# Altium schematic sheet Top.SchDoc: ECU V2
size 420 x 297 mm; Date: 10/25/22; Author: Joseph Telaak; CompanyName: autogolfc.art; DrawnBy: Joseph Telaak; Engineer: Joseph Telaak; Organization: autogolfc.art; Revision: 2.1; SheetNumber: 1; SheetTotal: 11; Time: OCT 20
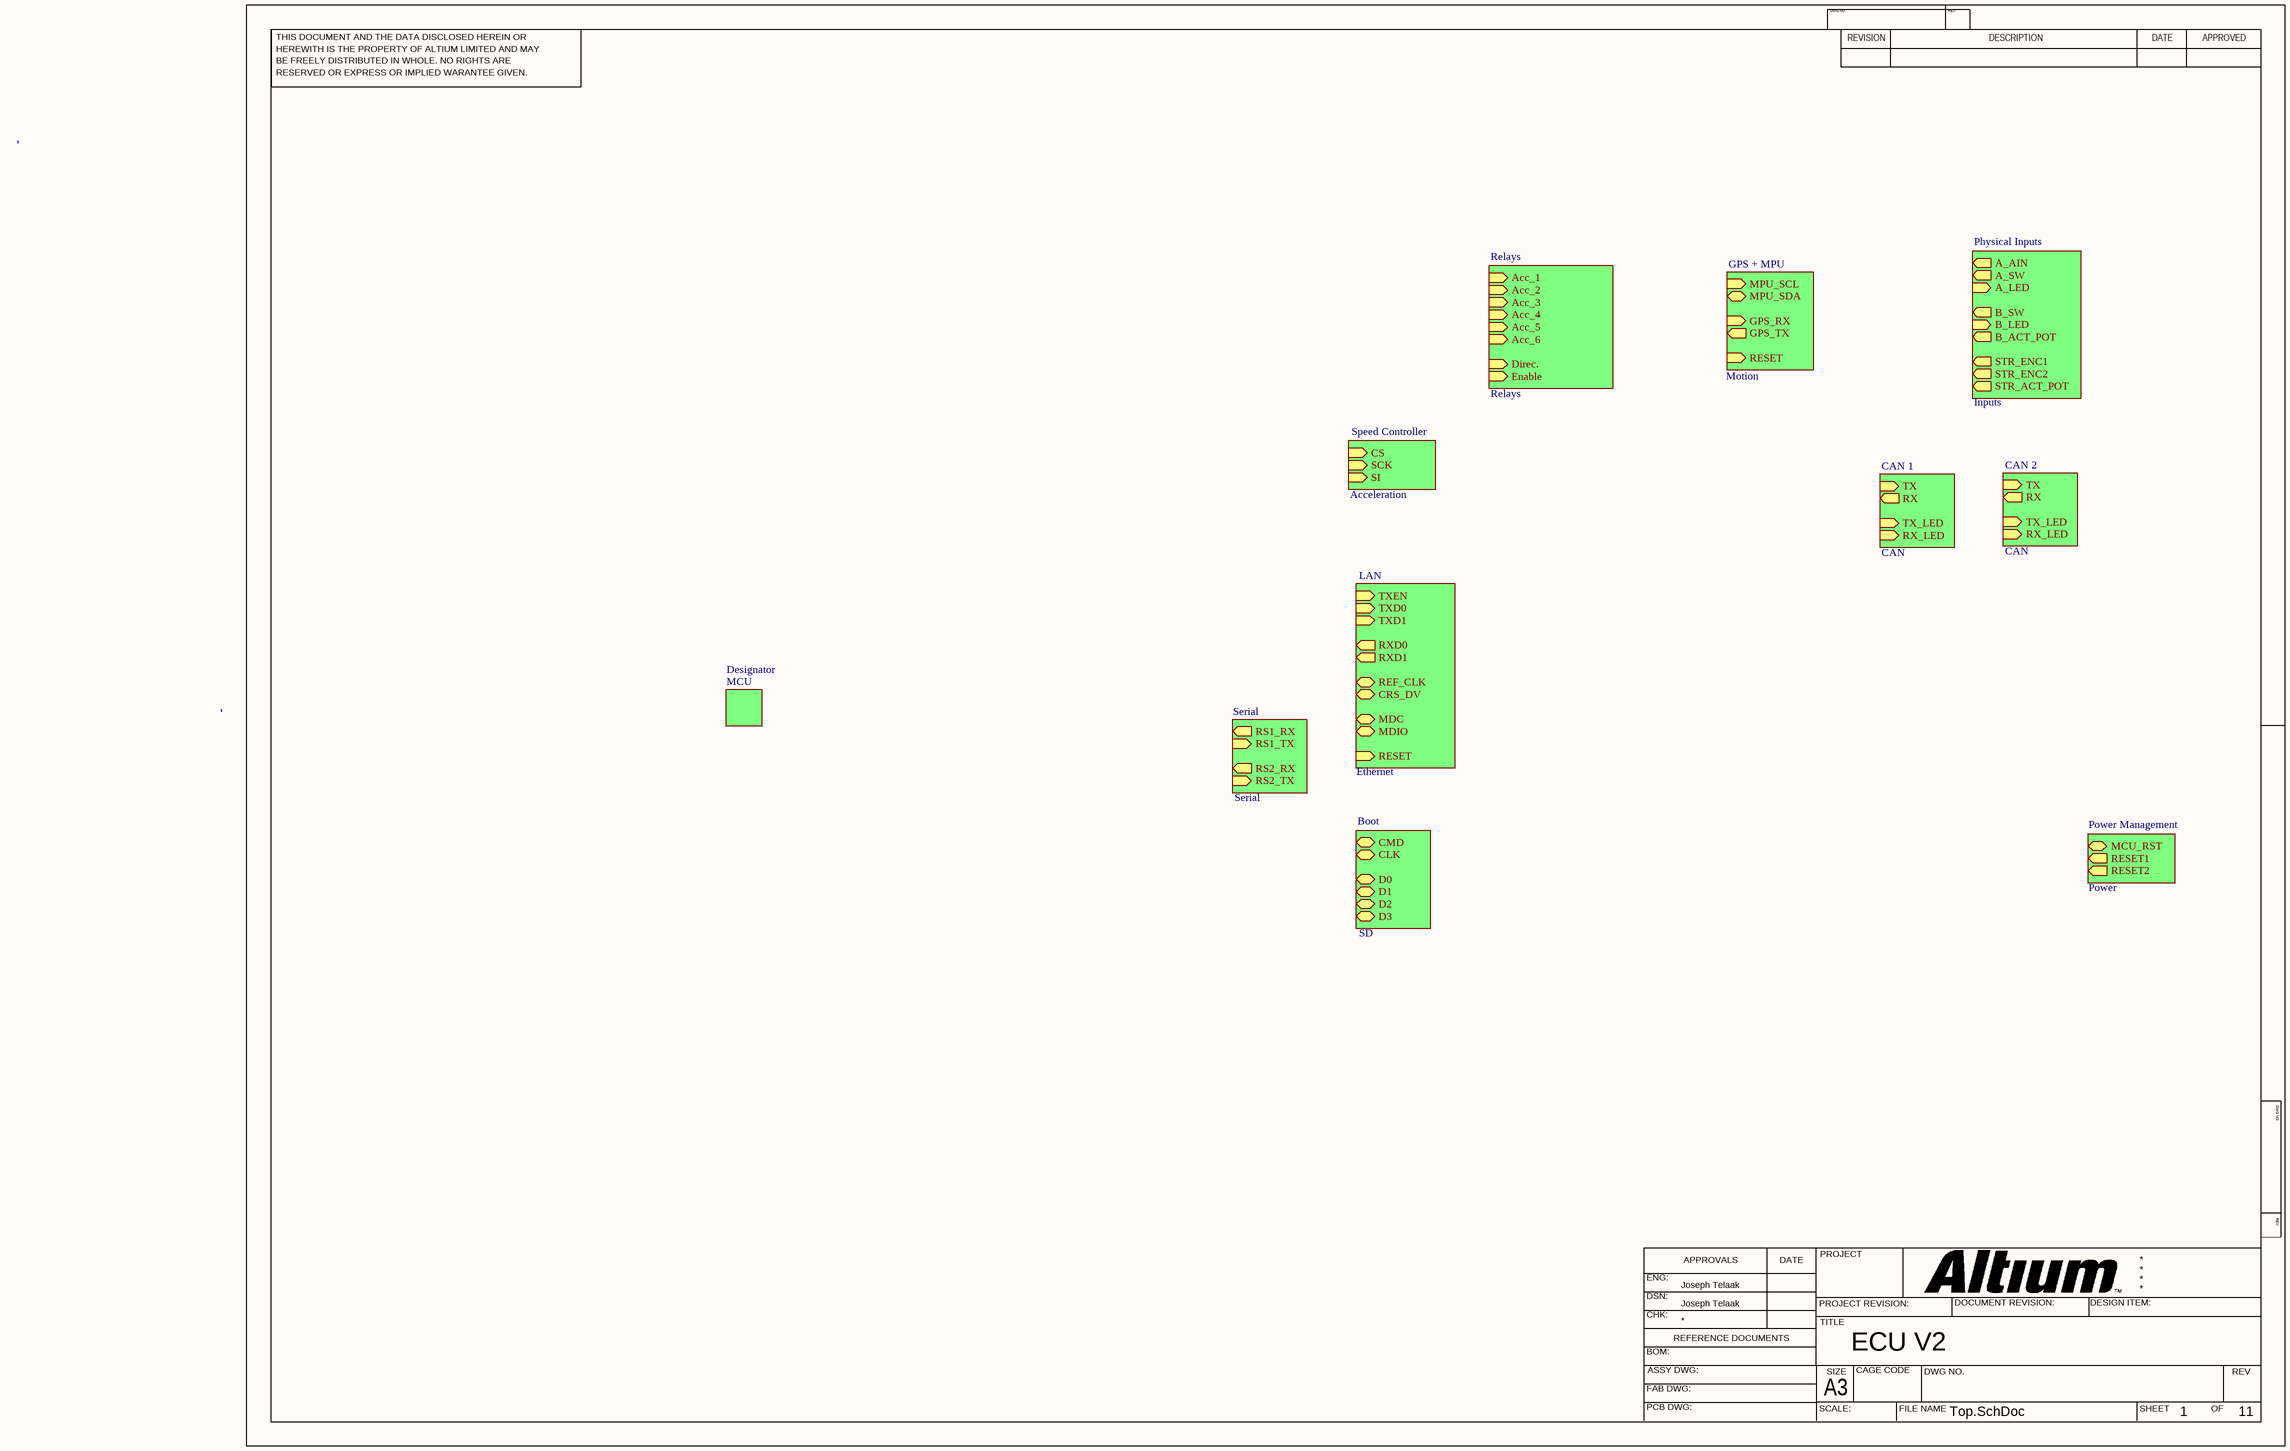
[diagram p0: Top.SchDoc]

## Sub-sheets
Boot = SD: CMD (bidir), CLK (bidir), D0 (bidir), D1 (bidir), D2 (bidir), D3 (bidir)
CAN 1 = CAN: TX (in), RX (out), TX_LED (in), RX_LED (in)
CAN 2 = CAN: TX (in), RX (out), TX_LED (in), RX_LED (in)
Designator = MCU: no entries
GPS + MPU = Motion: MPU_SCL (in), MPU_SDA (bidir), GPS_RX (in), GPS_TX (out), RESET (in)
LAN = Ethernet: TXEN (in), TXD0 (in), TXD1 (in), RXD0 (out), RXD1 (out), REF_CLK (bidir), CRS_DV (bidir), MDC (bidir), MDIO (bidir), RESET (in)
Physical Inputs = Inputs: A_AIN (out), A_SW (out), A_LED (in), B_SW (out), B_LED (in), STR_ENC1 (out), STR_ENC2 (out), B_ACT_POT (out), STR_ACT_POT (out)
Power Management = Power: MCU_RST (bidir), RESET1 (out), RESET2 (out)
Relays = Relays: Acc_1 (in), Acc_2 (in), Acc_3 (in), Acc_4 (in), Acc_5 (in), Acc_6 (in), Direc. (in), Enable (in)
Serial = Serial: RS1_TX (in), RS1_RX (out), RS2_RX (out), RS2_TX (in)
Speed Controller = Acceleration: CS (in), SCK (in), SI (in)

## Notes on the sheet
- THIS DOCUMENT AND THE DATA DISCLOSED HEREIN OR
- HEREWITH IS THE PROPERTY OF ALTIUM LIMITED AND MAY
- DWG NO:
- REVISION
- REV:
- DESCRIPTION
- DATE
- APPROVED
- BE FREELY DISTRIBUTED IN WHOLE. NO RIGHTS ARE
- RESERVED OR EXPRESS OR IMPLIED WARANTEE GIVEN.
- ENG:
- APPROVALS
- PROJECT
- DSN:
- CHK:
- REFERENCE DOCUMENTS
- PROJECT REVISION:
- TITLE
- DOCUMENT REVISION:
- DESIGN ITEM:
- BOM:
- FAB DWG:
- PCB DWG:
- ASSY DWG:
- SCALE:
- A3
- SIZE
- CAGE CODE
- FILE NAME
- DWG NO.
- SHEET
- OF
- REV